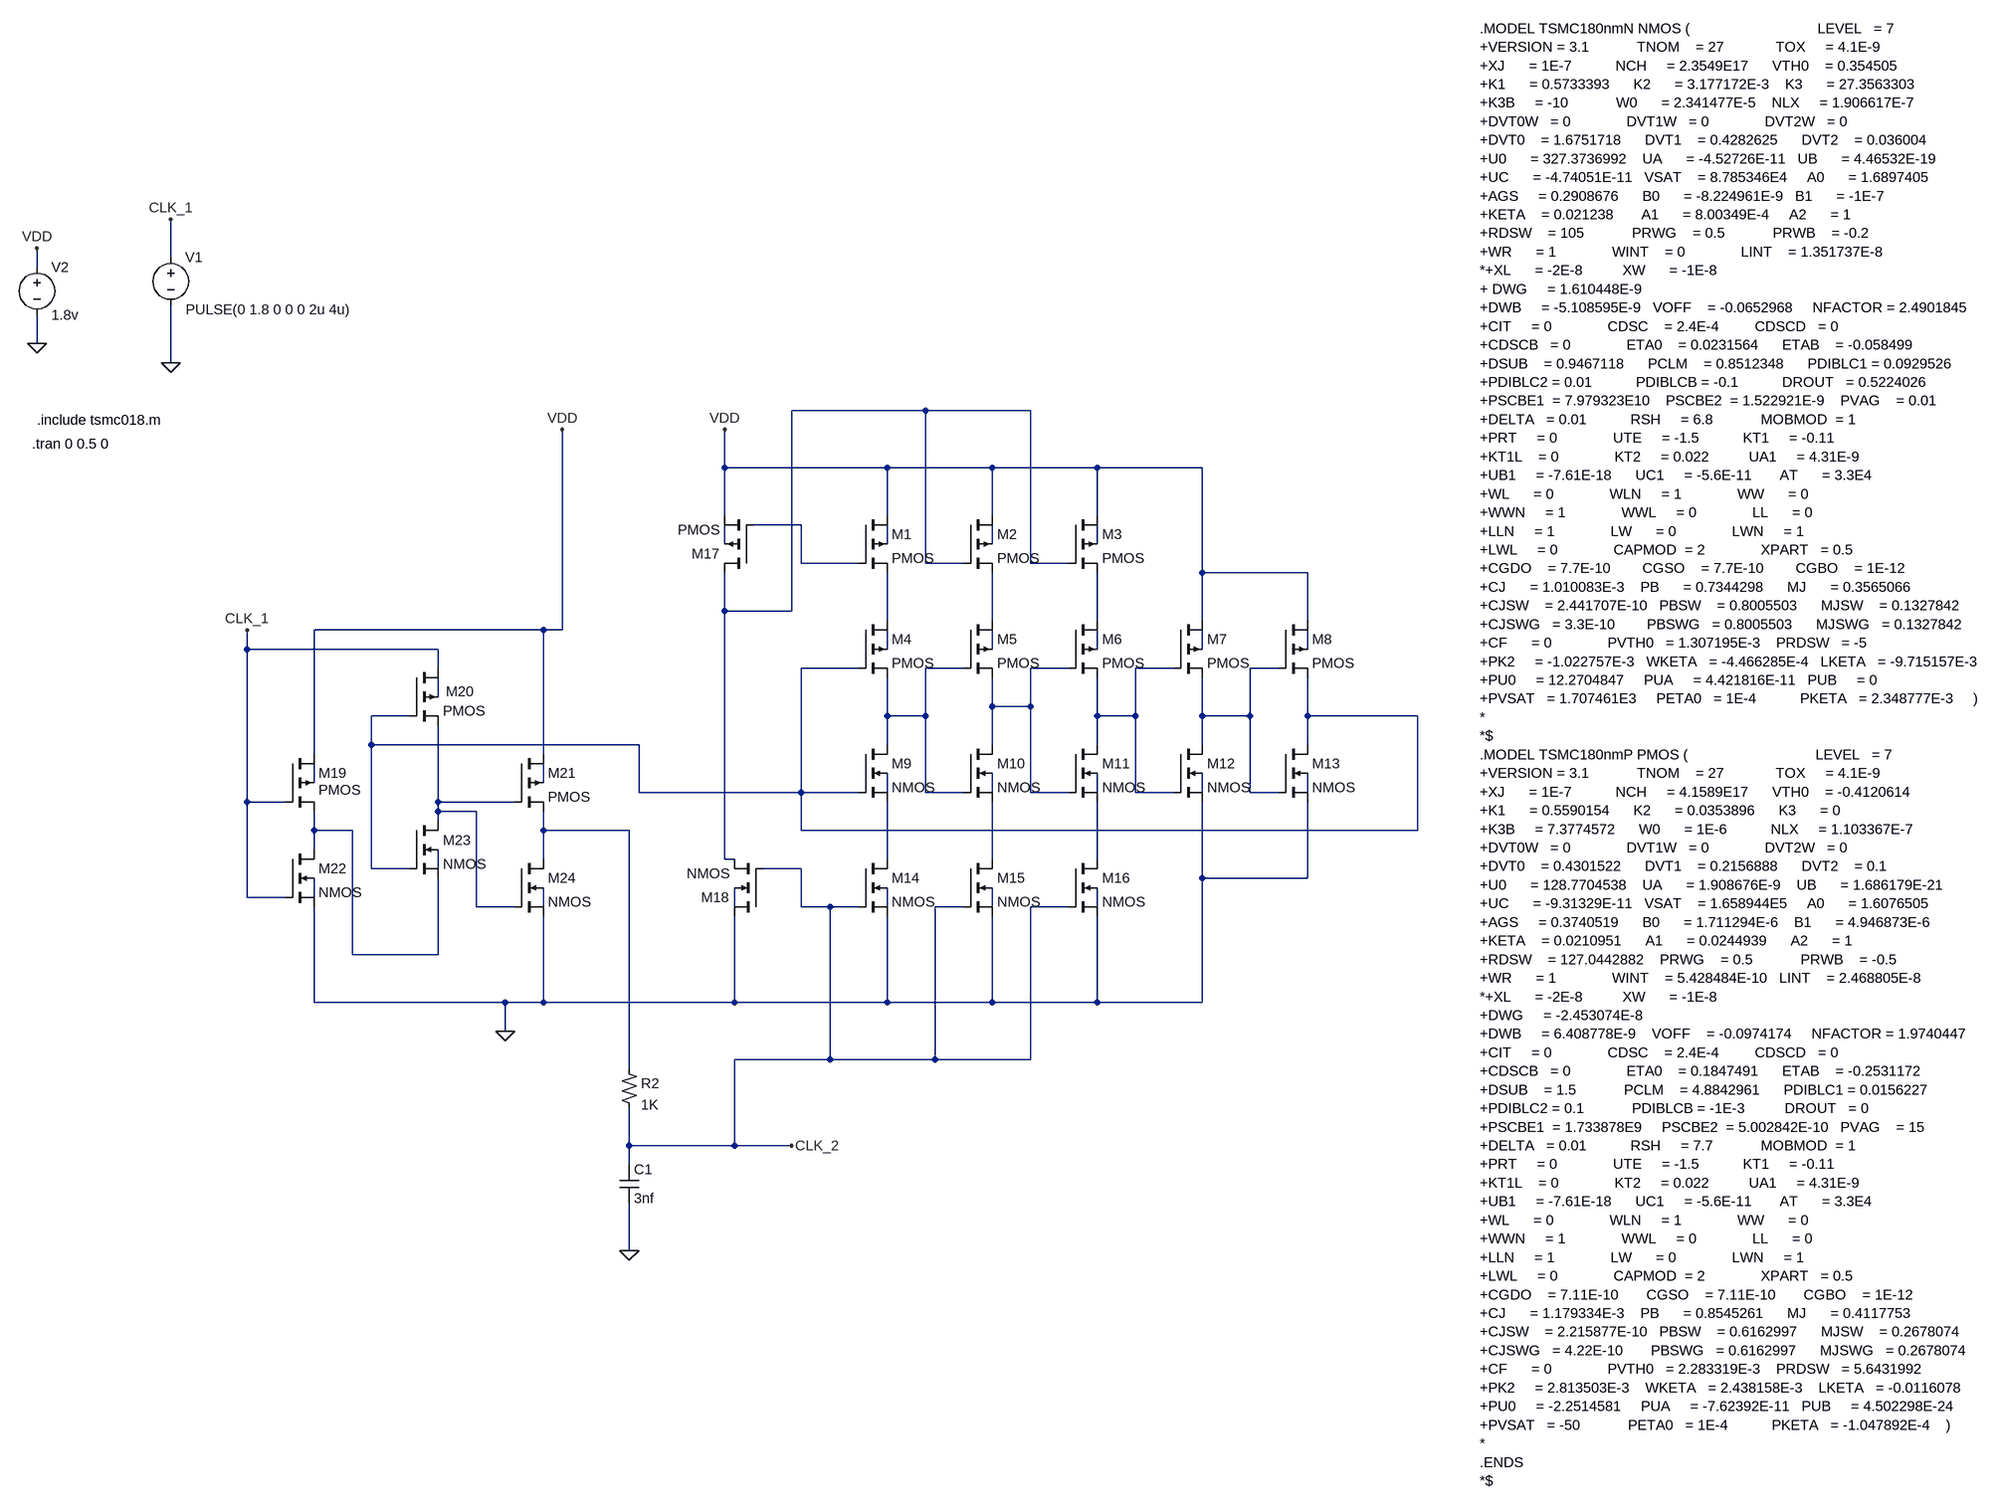
[diagram p0: schematic clock_multiplier_PLL (1).asc]
clock_multiplier_PLL (1).asc, the LTspice schematic file:
Version 4
SHEET 1 4840 1956
WIRE -992 -368 -992 -432
WIRE -1216 -352 -1216 -384
WIRE -1216 -224 -1216 -272
WIRE -992 -192 -992 -288
WIRE 272 -112 48 -112
WIRE 448 -112 272 -112
WIRE -64 -16 -64 -80
WIRE 208 -16 -64 -16
WIRE 384 -16 208 -16
WIRE 560 -16 384 -16
WIRE 736 -16 560 -16
WIRE -64 64 -64 -16
WIRE 208 64 208 -16
WIRE 384 64 384 -16
WIRE 560 64 560 -16
WIRE 64 80 -16 80
WIRE -64 112 -64 80
WIRE 208 112 208 80
WIRE 384 112 384 80
WIRE 560 112 560 80
WIRE 64 144 64 80
WIRE 160 144 64 144
WIRE 272 144 272 -112
WIRE 336 144 272 144
WIRE 448 144 448 -112
WIRE 512 144 448 144
WIRE 736 160 736 -16
WIRE 912 160 736 160
WIRE -64 224 -64 160
WIRE 48 224 48 -112
WIRE 48 224 -64 224
WIRE 208 240 208 160
WIRE 384 240 384 160
WIRE 560 240 560 160
WIRE 736 240 736 160
WIRE 912 240 912 160
WIRE -368 256 -752 256
WIRE -336 256 -336 -80
WIRE -336 256 -368 256
WIRE -864 288 -864 256
WIRE -544 288 -864 288
WIRE 208 288 208 256
WIRE 384 288 384 256
WIRE 560 288 560 256
WIRE 736 288 736 256
WIRE 912 288 912 256
WIRE -544 320 -544 288
WIRE 160 320 64 320
WIRE 336 320 272 320
WIRE 512 320 448 320
WIRE 688 320 624 320
WIRE 864 320 816 320
WIRE -544 368 -544 336
WIRE 384 384 384 336
WIRE 448 384 448 320
WIRE 448 384 384 384
WIRE -592 400 -656 400
WIRE 208 400 208 336
WIRE 272 400 272 320
WIRE 272 400 208 400
WIRE 560 400 560 336
WIRE 624 400 624 320
WIRE 624 400 560 400
WIRE 736 400 736 336
WIRE 816 400 816 320
WIRE 816 400 736 400
WIRE 912 400 912 336
WIRE 1120 400 912 400
WIRE -656 448 -656 400
WIRE -208 448 -656 448
WIRE 208 448 208 400
WIRE 384 448 384 384
WIRE 560 448 560 400
WIRE 736 448 736 400
WIRE 912 448 912 400
WIRE -752 464 -752 256
WIRE -368 464 -368 256
WIRE -752 512 -752 480
WIRE -368 512 -368 480
WIRE -208 528 -208 448
WIRE 64 528 64 320
WIRE 64 528 -208 528
WIRE 160 528 64 528
WIRE 208 528 208 496
WIRE 272 528 272 400
WIRE 336 528 272 528
WIRE 384 528 384 496
WIRE 448 528 448 384
WIRE 512 528 448 528
WIRE 560 528 560 496
WIRE 624 528 624 400
WIRE 688 528 624 528
WIRE 736 528 736 496
WIRE 816 528 816 400
WIRE 864 528 816 528
WIRE 912 528 912 496
WIRE -864 544 -864 288
WIRE -800 544 -864 544
WIRE -544 544 -544 416
WIRE -416 544 -544 544
WIRE -544 560 -544 544
WIRE -480 560 -544 560
WIRE -544 576 -544 560
WIRE -752 592 -752 560
WIRE -688 592 -752 592
WIRE -368 592 -368 560
WIRE -224 592 -368 592
WIRE 64 592 64 528
WIRE 1120 592 1120 400
WIRE 1120 592 64 592
WIRE -752 624 -752 592
WIRE -368 640 -368 592
WIRE -64 640 -64 224
WIRE -48 640 -64 640
WIRE 208 640 208 544
WIRE 384 640 384 544
WIRE 560 640 560 544
WIRE -656 656 -656 448
WIRE -592 656 -656 656
WIRE -544 656 -544 624
WIRE 64 656 0 656
WIRE 736 672 736 544
WIRE 912 672 912 544
WIRE 912 672 736 672
WIRE -864 704 -864 544
WIRE -800 704 -864 704
WIRE -752 704 -752 672
WIRE -480 720 -480 560
WIRE -416 720 -480 720
WIRE -368 720 -368 688
WIRE -48 720 -48 688
WIRE 64 720 64 656
WIRE 112 720 64 720
WIRE 160 720 112 720
WIRE 208 720 208 688
WIRE 336 720 288 720
WIRE 384 720 384 688
WIRE 512 720 448 720
WIRE 560 720 560 688
WIRE -688 800 -688 592
WIRE -544 800 -544 672
WIRE -544 800 -688 800
WIRE -752 880 -752 720
WIRE -432 880 -752 880
WIRE -368 880 -368 736
WIRE -368 880 -432 880
WIRE -48 880 -48 736
WIRE -48 880 -368 880
WIRE 208 880 208 736
WIRE 208 880 -48 880
WIRE 384 880 384 736
WIRE 384 880 208 880
WIRE 560 880 560 736
WIRE 560 880 384 880
WIRE 736 880 736 672
WIRE 736 880 560 880
WIRE -432 928 -432 880
WIRE 112 976 112 720
WIRE 112 976 -48 976
WIRE 288 976 288 720
WIRE 288 976 112 976
WIRE 448 976 448 720
WIRE 448 976 288 976
WIRE -224 992 -224 592
WIRE -224 1120 -224 1056
WIRE -48 1120 -48 976
WIRE -48 1120 -224 1120
WIRE 48 1120 -48 1120
WIRE -224 1152 -224 1120
WIRE -224 1296 -224 1216
FLAG -224 1296 0
FLAG -1216 -224 0
FLAG -992 -192 0
FLAG -432 928 0
FLAG -1216 -384 VDD
FLAG -64 -80 VDD
FLAG -336 -80 VDD
FLAG -992 -432 CLK_1
FLAG -864 256 CLK_1
FLAG 48 1120 CLK_2
SYMBOL pmos4 160 64 R0
SYMATTR InstName M1
SYMATTR Value2 l=0.18u w=0.9u m=1
SYMBOL pmos4 336 64 R0
SYMATTR InstName M2
SYMATTR Value2 l=0.18u w=0.9u m=1
SYMBOL pmos4 512 64 R0
SYMATTR InstName M3
SYMATTR Value2 l=0.18u w=0.9u m=1
SYMBOL pmos4 160 240 R0
SYMATTR InstName M4
SYMATTR Value2 l=0.18u w=0.9u m=1
SYMBOL pmos4 512 240 R0
SYMATTR InstName M6
SYMATTR Value2 l=0.18u w=0.9u m=1
SYMBOL pmos4 688 240 R0
SYMATTR InstName M7
SYMATTR Value2 l=0.18u w=0.9u m=1
SYMBOL pmos4 864 240 R0
SYMATTR InstName M8
SYMATTR Value2 l=0.18u w=0.9u m=1
SYMBOL nmos4 160 448 R0
SYMATTR InstName M9
SYMATTR Value2 l=0.18u w=0.36u m=1
SYMBOL nmos4 336 448 R0
SYMATTR InstName M10
SYMATTR Value2 l=0.18u w=0.36u m=1
SYMBOL nmos4 512 448 R0
SYMATTR InstName M11
SYMATTR Value2 l=0.18u w=0.36u m=1
SYMBOL nmos4 688 448 R0
SYMATTR InstName M12
SYMATTR Value2 l=0.18u w=0.36u m=1
SYMBOL nmos4 864 448 R0
SYMATTR InstName M13
SYMATTR Value2 l=0.18u w=0.36u m=1
SYMBOL nmos4 160 640 R0
SYMATTR InstName M14
SYMATTR Value2 l=0.18u w=0.36u m=1
SYMBOL nmos4 336 640 R0
SYMATTR InstName M15
SYMATTR Value2 l=0.18u w=0.36u m=1
SYMBOL nmos4 512 640 R0
SYMATTR InstName M16
SYMATTR Value2 l=0.18u w=0.36u m=1
SYMBOL pmos4 336 240 R0
SYMATTR InstName M5
SYMATTR Value2 l=0.18u w=0.9u m=1
SYMBOL pmos4 -16 160 R180
SYMATTR InstName M17
SYMATTR Value2 l=0.18u w=0.9u m=1
SYMBOL nmos4 0 736 R180
SYMATTR InstName M18
SYMATTR Value2 l=0.18u w=0.36u m=1
SYMBOL pmos4 -800 464 R0
WINDOW 3 56 60 Left 2
SYMATTR InstName M19
SYMATTR Value2 l=0.18u w=0.9u m=1
SYMBOL pmos4 -592 320 R0
WINDOW 0 61 39 Left 2
SYMATTR InstName M20
SYMATTR Value2 l=0.18u w=0.9u m=1
SYMBOL pmos4 -416 464 R0
SYMATTR InstName M21
SYMATTR Value2 l=0.18u w=0.9u m=1
SYMBOL nmos4 -800 624 R0
SYMATTR InstName M22
SYMATTR Value2 l=0.18u w=0.36u m=1
SYMBOL nmos4 -592 576 R0
SYMATTR InstName M23
SYMATTR Value2 l=0.18u w=0.36u m=1
SYMBOL nmos4 -416 640 R0
SYMATTR InstName M24
SYMATTR Value2 l=0.18u w=0.36u m=1
SYMBOL voltage -992 -384 R0
WINDOW 3 25 103 Left 2
WINDOW 123 0 0 Left 0
WINDOW 39 0 0 Left 0
SYMATTR Value PULSE(0 1.8 0 0 0 2u 4u)
SYMATTR InstName V1
SYMBOL voltage -1216 -368 R0
WINDOW 123 0 0 Left 0
WINDOW 39 0 0 Left 0
SYMATTR InstName V2
SYMATTR Value 1.8v
SYMBOL res2 -240 992 R0
SYMATTR InstName R2
SYMATTR Value 1K
SYMATTR SpiceLine tol=1 pwr=0.1
SYMBOL cap -240 1152 R0
SYMATTR InstName C1
SYMATTR Value 3nf
TEXT -1224 -56 Left 2 !.tran 0 0.5 0
TEXT 1632 -752 Left 2 !.MODEL TSMC180nmN NMOS (                                LEVEL   = 7\n+VERSION = 3.1            TNOM    = 27             TOX     = 4.1E-9\n+XJ      = 1E-7           NCH     = 2.3549E17      VTH0    = 0.354505\n+K1      = 0.5733393      K2      = 3.177172E-3    K3      = 27.3563303\n+K3B     = -10            W0      = 2.341477E-5    NLX     = 1.906617E-7\n+DVT0W   = 0              DVT1W   = 0              DVT2W   = 0\n+DVT0    = 1.6751718      DVT1    = 0.4282625      DVT2    = 0.036004\n+U0      = 327.3736992    UA      = -4.52726E-11   UB      = 4.46532E-19\n+UC      = -4.74051E-11   VSAT    = 8.785346E4     A0      = 1.6897405\n+AGS     = 0.2908676      B0      = -8.224961E-9   B1      = -1E-7\n+KETA    = 0.021238       A1      = 8.00349E-4     A2      = 1\n+RDSW    = 105            PRWG    = 0.5            PRWB    = -0.2\n+WR      = 1              WINT    = 0              LINT    = 1.351737E-8\n*+XL      = -2E-8          XW      = -1E-8         \n+ DWG     = 1.610448E-9\n+DWB     = -5.108595E-9   VOFF    = -0.0652968     NFACTOR = 2.4901845\n+CIT     = 0              CDSC    = 2.4E-4         CDSCD   = 0\n+CDSCB   = 0              ETA0    = 0.0231564      ETAB    = -0.058499\n+DSUB    = 0.9467118      PCLM    = 0.8512348      PDIBLC1 = 0.0929526\n+PDIBLC2 = 0.01           PDIBLCB = -0.1           DROUT   = 0.5224026\n+PSCBE1  = 7.979323E10    PSCBE2  = 1.522921E-9    PVAG    = 0.01\n+DELTA   = 0.01           RSH     = 6.8            MOBMOD  = 1\n+PRT     = 0              UTE     = -1.5           KT1     = -0.11\n+KT1L    = 0              KT2     = 0.022          UA1     = 4.31E-9\n+UB1     = -7.61E-18      UC1     = -5.6E-11       AT      = 3.3E4\n+WL      = 0              WLN     = 1              WW      = 0\n+WWN     = 1              WWL     = 0              LL      = 0\n+LLN     = 1              LW      = 0              LWN     = 1\n+LWL     = 0              CAPMOD  = 2              XPART   = 0.5\n+CGDO    = 7.7E-10        CGSO    = 7.7E-10        CGBO    = 1E-12\n+CJ      = 1.010083E-3    PB      = 0.7344298      MJ      = 0.3565066\n+CJSW    = 2.441707E-10   PBSW    = 0.8005503      MJSW    = 0.1327842\n+CJSWG   = 3.3E-10        PBSWG   = 0.8005503      MJSWG   = 0.1327842\n+CF      = 0              PVTH0   = 1.307195E-3    PRDSW   = -5\n+PK2     = -1.022757E-3   WKETA   = -4.466285E-4   LKETA   = -9.715157E-3\n+PU0     = 12.2704847     PUA     = 4.421816E-11   PUB     = 0\n+PVSAT   = 1.707461E3     PETA0   = 1E-4           PKETA   = 2.348777E-3     )\n*\n*$\n.MODEL TSMC180nmP PMOS (                                LEVEL   = 7\n+VERSION = 3.1            TNOM    = 27             TOX     = 4.1E-9\n+XJ      = 1E-7           NCH     = 4.1589E17      VTH0    = -0.4120614\n+K1      = 0.5590154      K2      = 0.0353896      K3      = 0\n+K3B     = 7.3774572      W0      = 1E-6           NLX     = 1.103367E-7\n+DVT0W   = 0              DVT1W   = 0              DVT2W   = 0\n+DVT0    = 0.4301522      DVT1    = 0.2156888      DVT2    = 0.1\n+U0      = 128.7704538    UA      = 1.908676E-9    UB      = 1.686179E-21\n+UC      = -9.31329E-11   VSAT    = 1.658944E5     A0      = 1.6076505\n+AGS     = 0.3740519      B0      = 1.711294E-6    B1      = 4.946873E-6\n+KETA    = 0.0210951      A1      = 0.0244939      A2      = 1\n+RDSW    = 127.0442882    PRWG    = 0.5            PRWB    = -0.5\n+WR      = 1              WINT    = 5.428484E-10   LINT    = 2.468805E-8\n*+XL      = -2E-8          XW      = -1E-8          \n+DWG     = -2.453074E-8\n+DWB     = 6.408778E-9    VOFF    = -0.0974174     NFACTOR = 1.9740447\n+CIT     = 0              CDSC    = 2.4E-4         CDSCD   = 0\n+CDSCB   = 0              ETA0    = 0.1847491      ETAB    = -0.2531172\n+DSUB    = 1.5            PCLM    = 4.8842961      PDIBLC1 = 0.0156227\n+PDIBLC2 = 0.1            PDIBLCB = -1E-3          DROUT   = 0\n+PSCBE1  = 1.733878E9     PSCBE2  = 5.002842E-10   PVAG    = 15\n+DELTA   = 0.01           RSH     = 7.7            MOBMOD  = 1\n+PRT     = 0              UTE     = -1.5           KT1     = -0.11\n+KT1L    = 0              KT2     = 0.022          UA1     = 4.31E-9\n+UB1     = -7.61E-18      UC1     = -5.6E-11       AT      = 3.3E4\n+WL      = 0              WLN     = 1              WW      = 0\n+WWN     = 1              WWL     = 0              LL      = 0\n+LLN     = 1              LW      = 0              LWN     = 1\n+LWL     = 0              CAPMOD  = 2              XPART   = 0.5\n+CGDO    = 7.11E-10       CGSO    = 7.11E-10       CGBO    = 1E-12\n+CJ      = 1.179334E-3    PB      = 0.8545261      MJ      = 0.4117753\n+CJSW    = 2.215877E-10   PBSW    = 0.6162997      MJSW    = 0.2678074\n+CJSWG   = 4.22E-10       PBSWG   = 0.6162997      MJSWG   = 0.2678074\n+CF      = 0              PVTH0   = 2.283319E-3    PRDSW   = 5.6431992\n+PK2     = 2.813503E-3    WKETA   = 2.438158E-3    LKETA   = -0.0116078\n+PU0     = -2.2514581     PUA     = -7.62392E-11   PUB     = 4.502298E-24\n+PVSAT   = -50            PETA0   = 1E-4           PKETA   = -1.047892E-4    )\n*\n.ENDS    \n*$
TEXT -1216 -96 Left 2 !.include tsmc018.m

The netlist it stands for:
* clock_multiplier_PLL (1).asc
M1 VDD N002 N007 N004 PMOS l=0.18u w=0.9u m=1
M2 VDD N001 N008 N005 PMOS l=0.18u w=0.9u m=1
M3 VDD N001 N009 N006 PMOS l=0.18u w=0.9u m=1
M4 N007 N015 N016 N010 PMOS l=0.18u w=0.9u m=1
M6 N009 N017 N018 N012 PMOS l=0.18u w=0.9u m=1
M7 VDD N018 N019 N013 PMOS l=0.18u w=0.9u m=1
M8 VDD N019 N015 N014 PMOS l=0.18u w=0.9u m=1
M9 N016 N015 N031 N023 NMOS l=0.18u w=0.36u m=1
M10 N017 N016 N032 N024 NMOS l=0.18u w=0.36u m=1
M11 N018 N017 N033 N025 NMOS l=0.18u w=0.36u m=1
M12 N019 N018 0 N026 NMOS l=0.18u w=0.36u m=1
M13 N015 N019 0 N027 NMOS l=0.18u w=0.36u m=1
M14 N031 CLK_2 0 N038 NMOS l=0.18u w=0.36u m=1
M15 N032 CLK_2 0 N039 NMOS l=0.18u w=0.36u m=1
M16 N033 CLK_2 0 N040 NMOS l=0.18u w=0.36u m=1
M5 N008 N016 N017 N011 PMOS l=0.18u w=0.9u m=1
M17 N001 N002 VDD N003 PMOS l=0.18u w=0.9u m=1
M18 0 CLK_2 N001 N037 NMOS l=0.18u w=0.36u m=1
M19 VDD CLK_1 N029 N021 PMOS l=0.18u w=0.9u m=1
M20 CLK_1 N015 N028 N020 PMOS l=0.18u w=0.9u m=1
M21 VDD N028 N030 N022 PMOS l=0.18u w=0.9u m=1
M22 N029 CLK_1 0 N035 NMOS l=0.18u w=0.36u m=1
M23 N028 N015 N029 N034 NMOS l=0.18u w=0.36u m=1
M24 N030 N028 0 N036 NMOS l=0.18u w=0.36u m=1
V1 CLK_1 0 PULSE(0 1.8 0 0 0 2u 4u)
V2 VDD 0 1.8v
R2 N030 CLK_2 1K tol=1 pwr=0.1
C1 CLK_2 0 3nf
.model NMOS NMOS
.model PMOS PMOS
.lib standard.mos
.tran 0 0.5 0
.MODEL TSMC180nmN NMOS (                                LEVEL   = 7
+VERSION = 3.1            TNOM    = 27             TOX     = 4.1E-9
+XJ      = 1E-7           NCH     = 2.3549E17      VTH0    = 0.354505
+K1      = 0.5733393      K2      = 3.177172E-3    K3      = 27.3563303
+K3B     = -10            W0      = 2.341477E-5    NLX     = 1.906617E-7
+DVT0W   = 0              DVT1W   = 0              DVT2W   = 0
+DVT0    = 1.6751718      DVT1    = 0.4282625      DVT2    = 0.036004
+U0      = 327.3736992    UA      = -4.52726E-11   UB      = 4.46532E-19
+UC      = -4.74051E-11   VSAT    = 8.785346E4     A0      = 1.6897405
+AGS     = 0.2908676      B0      = -8.224961E-9   B1      = -1E-7
+KETA    = 0.021238       A1      = 8.00349E-4     A2      = 1
+RDSW    = 105            PRWG    = 0.5            PRWB    = -0.2
+WR      = 1              WINT    = 0              LINT    = 1.351737E-8
*+XL      = -2E-8          XW      = -1E-8
+ DWG     = 1.610448E-9
+DWB     = -5.108595E-9   VOFF    = -0.0652968     NFACTOR = 2.4901845
+CIT     = 0              CDSC    = 2.4E-4         CDSCD   = 0
+CDSCB   = 0              ETA0    = 0.0231564      ETAB    = -0.058499
+DSUB    = 0.9467118      PCLM    = 0.8512348      PDIBLC1 = 0.0929526
+PDIBLC2 = 0.01           PDIBLCB = -0.1           DROUT   = 0.5224026
+PSCBE1  = 7.979323E10    PSCBE2  = 1.522921E-9    PVAG    = 0.01
+DELTA   = 0.01           RSH     = 6.8            MOBMOD  = 1
+PRT     = 0              UTE     = -1.5           KT1     = -0.11
+KT1L    = 0              KT2     = 0.022          UA1     = 4.31E-9
+UB1     = -7.61E-18      UC1     = -5.6E-11       AT      = 3.3E4
+WL      = 0              WLN     = 1              WW      = 0
+WWN     = 1              WWL     = 0              LL      = 0
+LLN     = 1              LW      = 0              LWN     = 1
+LWL     = 0              CAPMOD  = 2              XPART   = 0.5
+CGDO    = 7.7E-10        CGSO    = 7.7E-10        CGBO    = 1E-12
+CJ      = 1.010083E-3    PB      = 0.7344298      MJ      = 0.3565066
+CJSW    = 2.441707E-10   PBSW    = 0.8005503      MJSW    = 0.1327842
+CJSWG   = 3.3E-10        PBSWG   = 0.8005503      MJSWG   = 0.1327842
+CF      = 0              PVTH0   = 1.307195E-3    PRDSW   = -5
+PK2     = -1.022757E-3   WKETA   = -4.466285E-4   LKETA   = -9.715157E-3
+PU0     = 12.2704847     PUA     = 4.421816E-11   PUB     = 0
+PVSAT   = 1.707461E3     PETA0   = 1E-4           PKETA   = 2.348777E-3     )
*
*$
.MODEL TSMC180nmP PMOS (                                LEVEL   = 7
+VERSION = 3.1            TNOM    = 27             TOX     = 4.1E-9
+XJ      = 1E-7           NCH     = 4.1589E17      VTH0    = -0.4120614
+K1      = 0.5590154      K2      = 0.0353896      K3      = 0
+K3B     = 7.3774572      W0      = 1E-6           NLX     = 1.103367E-7
+DVT0W   = 0              DVT1W   = 0              DVT2W   = 0
+DVT0    = 0.4301522      DVT1    = 0.2156888      DVT2    = 0.1
+U0      = 128.7704538    UA      = 1.908676E-9    UB      = 1.686179E-21
+UC      = -9.31329E-11   VSAT    = 1.658944E5     A0      = 1.6076505
+AGS     = 0.3740519      B0      = 1.711294E-6    B1      = 4.946873E-6
+KETA    = 0.0210951      A1      = 0.0244939      A2      = 1
+RDSW    = 127.0442882    PRWG    = 0.5            PRWB    = -0.5
+WR      = 1              WINT    = 5.428484E-10   LINT    = 2.468805E-8
*+XL      = -2E-8          XW      = -1E-8
+DWG     = -2.453074E-8
+DWB     = 6.408778E-9    VOFF    = -0.0974174     NFACTOR = 1.9740447
+CIT     = 0              CDSC    = 2.4E-4         CDSCD   = 0
+CDSCB   = 0              ETA0    = 0.1847491      ETAB    = -0.2531172
+DSUB    = 1.5            PCLM    = 4.8842961      PDIBLC1 = 0.0156227
+PDIBLC2 = 0.1            PDIBLCB = -1E-3          DROUT   = 0
+PSCBE1  = 1.733878E9     PSCBE2  = 5.002842E-10   PVAG    = 15
+DELTA   = 0.01           RSH     = 7.7            MOBMOD  = 1
+PRT     = 0              UTE     = -1.5           KT1     = -0.11
+KT1L    = 0              KT2     = 0.022          UA1     = 4.31E-9
+UB1     = -7.61E-18      UC1     = -5.6E-11       AT      = 3.3E4
+WL      = 0              WLN     = 1              WW      = 0
+WWN     = 1              WWL     = 0              LL      = 0
+LLN     = 1              LW      = 0              LWN     = 1
+LWL     = 0              CAPMOD  = 2              XPART   = 0.5
+CGDO    = 7.11E-10       CGSO    = 7.11E-10       CGBO    = 1E-12
+CJ      = 1.179334E-3    PB      = 0.8545261      MJ      = 0.4117753
+CJSW    = 2.215877E-10   PBSW    = 0.6162997      MJSW    = 0.2678074
+CJSWG   = 4.22E-10       PBSWG   = 0.6162997      MJSWG   = 0.2678074
+CF      = 0              PVTH0   = 2.283319E-3    PRDSW   = 5.6431992
+PK2     = 2.813503E-3    WKETA   = 2.438158E-3    LKETA   = -0.0116078
+PU0     = -2.2514581     PUA     = -7.62392E-11   PUB     = 4.502298E-24
+PVSAT   = -50            PETA0   = 1E-4           PKETA   = -1.047892E-4    )
*
.ENDS
*$
.include tsmc018.m
.backanno
.end